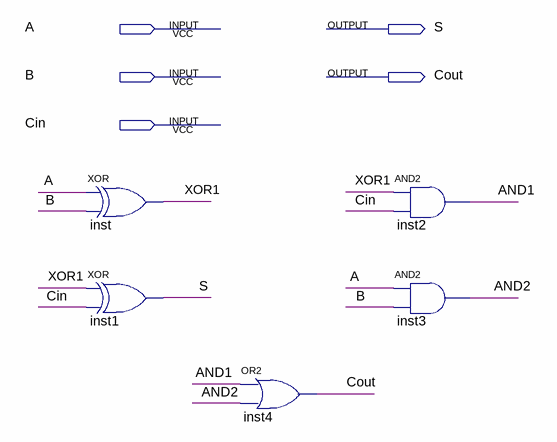
[diagram p0: schematic sheet]
// Quartus schematic FULL_ADDER.bdf as structural Verilog: 5 symbols, 5 pins
module FULL_ADDER (
  input  A,
  input  B,
  input  Cin,
  output S,
  output Cout
);

  wire AND1, AND2, XOR1;

  xor inst (XOR1, A, B);
  xor inst1 (S, XOR1, Cin);
  or inst4 (Cout, AND1, AND2);
  and inst2 (AND1, XOR1, Cin);
  and inst3 (AND2, A, B);
endmodule
